# EAGLE design RES (EAGLE 7.7.0)
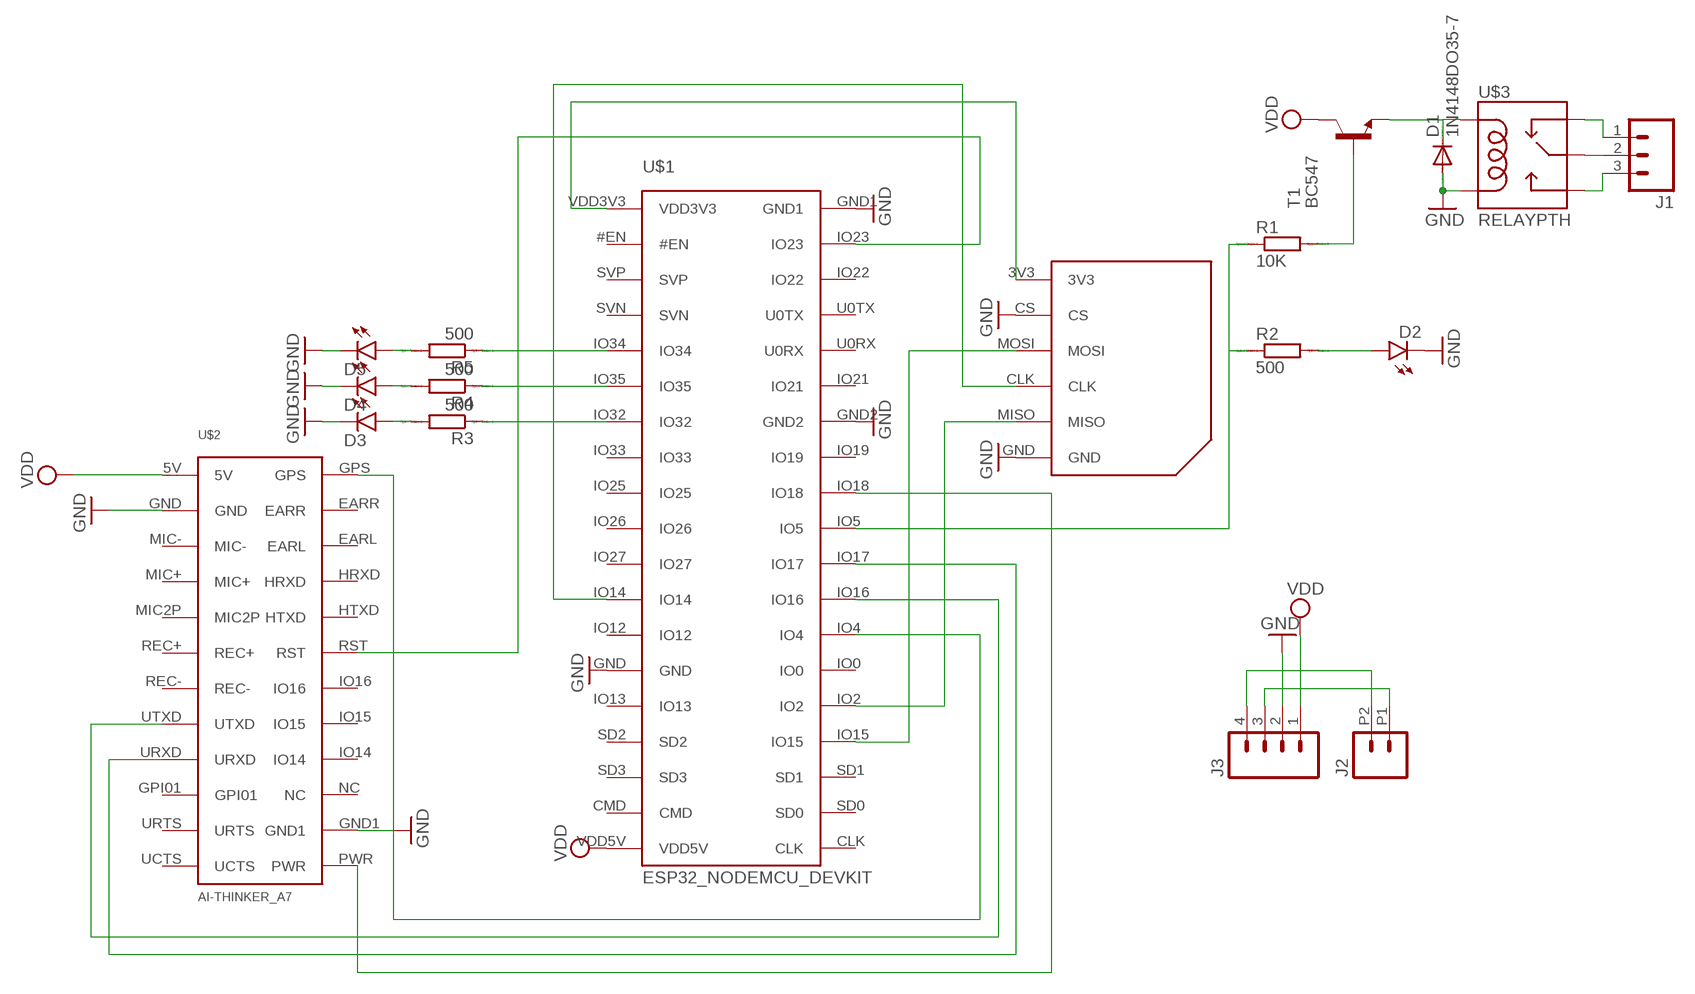
[diagram p0: schematic, sheet 1]

## Parts
D1  1N4148DO35-7  [DO35-7]
D2  LED3MM  [LED3MM]
D3  LED3MM  [LED3MM]
D4  LED3MM  [LED3MM]
D5  LED3MM  [LED3MM]
J1  M03-SCREW-5MM  [SCREWTERMINAL-5MM-3]
J2  M022.54MM_SCREWTERM  [1X02_2.54_SCREWTERM]
J3  M04SCREW  [SCREWTERMINAL-3.5MM-4]
R1  10K  R0204/7  [0204/7]
R2  500  R0204/7  [0204/7]
R3  500  R0204/7  [0204/7]
R4  500  R0204/7  [0204/7]
R5  500  R0204/7  [0204/7]
T1  BC547  [TO92]
U$1  ESP32_NODEMCU_DEVKIT  [ESP32_NODEMCU_PACKAGE]
U$2  AI-THINKER_A7  [AI-THINKER_A7_PAC]
U$3  RELAYPTH  [SRD-05VDC-SL-C]
U$4  SD-CARD_BREAKOUT  [SD-CARD_BREAKOUT_PACK]

## Nets
GND: D1.A D2.K(C) D3.K(C) D4.K(C) D5.K(C) J3.2 U$1.GND U$1.GND1 U$1.GND2 U$2.GND U$2.GND1 U$3.COIL0 U$4.CS U$4.GND
N$1: J1.1 U$3.SWCLOSED(SWCLOSE)
N$2: R1.1 R2.1 U$1.IO5
N$3: U$1.IO18 U$2.PWR
N$4: U$1.IO17 U$2.URXD
N$5: U$1.IO16 U$2.UTXD
N$6: U$1.IO4 U$2.GPS
N$7: R1.2 T1.2(B)
N$8: D1.C T1.1(E) U$3.COIL1
N$9: J1.2 U$3.SWCOMMON
N$10: D2.A R2.2
N$11: J1.3 U$3.SWOPEN
N$12: U$1.IO23 U$2.RST
N$13: J2.P1 J3.3
N$14: J2.P2 J3.4
N$15: U$1.VDD3V3 U$4.3V3
N$16: U$1.IO15 U$4.MOSI
N$17: U$1.IO14 U$4.CLK
N$18: U$1.IO2 U$4.MISO
N$19: D3.A R3.2
N$20: D4.A R4.2
N$21: D5.A R5.2
N$22: R5.1 U$1.IO34
N$23: R4.1 U$1.IO35
N$24: R3.1 U$1.IO32
VDD: J3.1 T1.3(C) U$1.VDD5V U$2.5V
Unconnected: U$1.#EN U$1.CLK U$1.CMD U$1.IO0 U$1.IO12 U$1.IO13 U$1.IO19 U$1.IO21 U$1.IO22 U$1.IO25 U$1.IO26 U$1.IO27 U$1.IO33 U$1.SD0 U$1.SD1 U$1.SD2 U$1.SD3 U$1.SVN U$1.SVP U$1.U0RX U$1.U0TX U$2.EARL U$2.EARR U$2.GPI01 U$2.HRXD U$2.HTXD U$2.IO14 U$2.IO15 U$2.IO16 U$2.MIC2P U$2.MIC+ U$2.MIC- U$2.NC U$2.REC+ U$2.REC- U$2.UCTS U$2.URTS

## Library data of the parts
D1 = diode:1N4148: DIODE high speed (Philips)
D2-D5 = SparkFun-LED:LED: LEDs Standard schematic elements and footprints for 5mm, 3mm, 1206, and 0603 sized LEDs. 5mm - Spark Fun Electronics SKU : COM-00529 (and others); PROD_ID: DIO-08794
J1 = SparkFun-Connectors:M03: Header 3 Standard 3-pin 0.1" header. Use with straight break away headers (SKU : PRT-00116), right angle break away headers (PRT-00553), swiss pins (PRT-00743), machine pins (PRT-00117), and female headers (PRT-00115). Molex polarized connector foot print use with SKU : PRT-08232 with associated crimp pins and housings.; STOREFRONT_ID: PRT-08433
J2 = SparkFun-Connectors:M02: Standard 2-pin 0.1" header. Use with - straight break away headers ( PRT-00116) - right angle break away headers (PRT-00553) - swiss pins (PRT-00743) - machine pins (PRT-00117) - female headers (PRT-00115) Molex polarized connector foot print use with: PRT-08233 with associated crimp pins and housings. 2.54_SCREWTERM for use with PRT-10571. 3.5mm Screw Terminal footprints for PRT-08084 5mm Screw Terminal footprints for use with PRT-08432
J3 = SparkFun-Connectors:M04: Header 4 Standard 4-pin 0.1" header. Use with straight break away headers (SKU : PRT-00116), right angle break away headers (PRT-00553), swiss pins (PRT-00743), machine pins (PRT-00117), and female headers (PRT-00115). Molex polarized connector foot print use with SKU : PRT-08231 with associated crimp pins and housings. 1MM SMD Version SKU: PRT-10208; PROD_ID: Combine 2x8399
R1-R5 = eagle-ltspice:R: RESISTOR, European symbol; SPICEMODEL: NONE; SPICEPREFIX: R
T1 = transistor:BC547: NPN TRANSISTOR
U$1 = esp32_nodemcu_devkit:ESP32_NODEMCU_DEVKIT
U$2 = AI-Thinker_A7:AI-THINKER_A7
U$3 = SRD-05VDC-SL-C:RELAY: SPDT relay (COM-00101)
U$4 = SD-CARD_BREAKOUT:SD-CARD_BREAKOUT

## Board
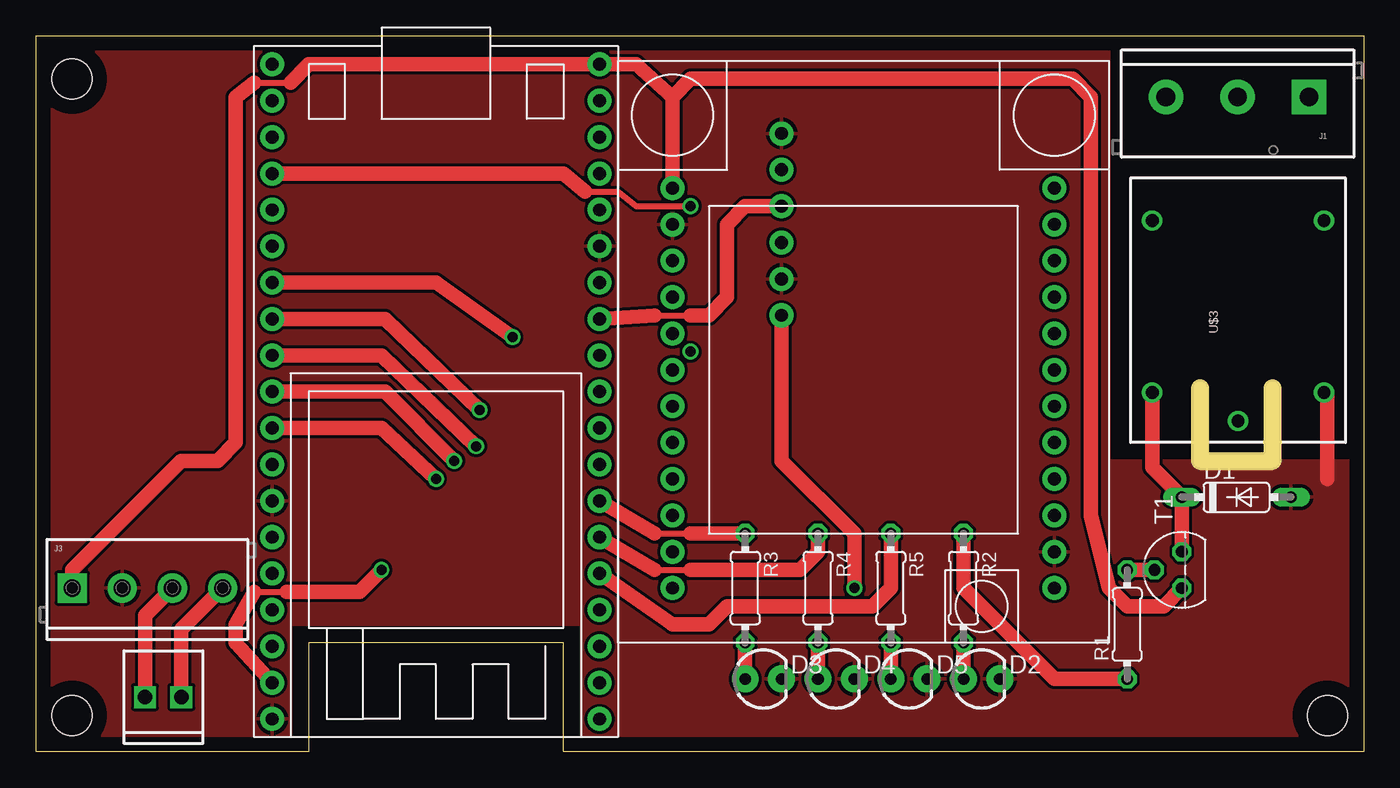
[diagram p1: board, top side]
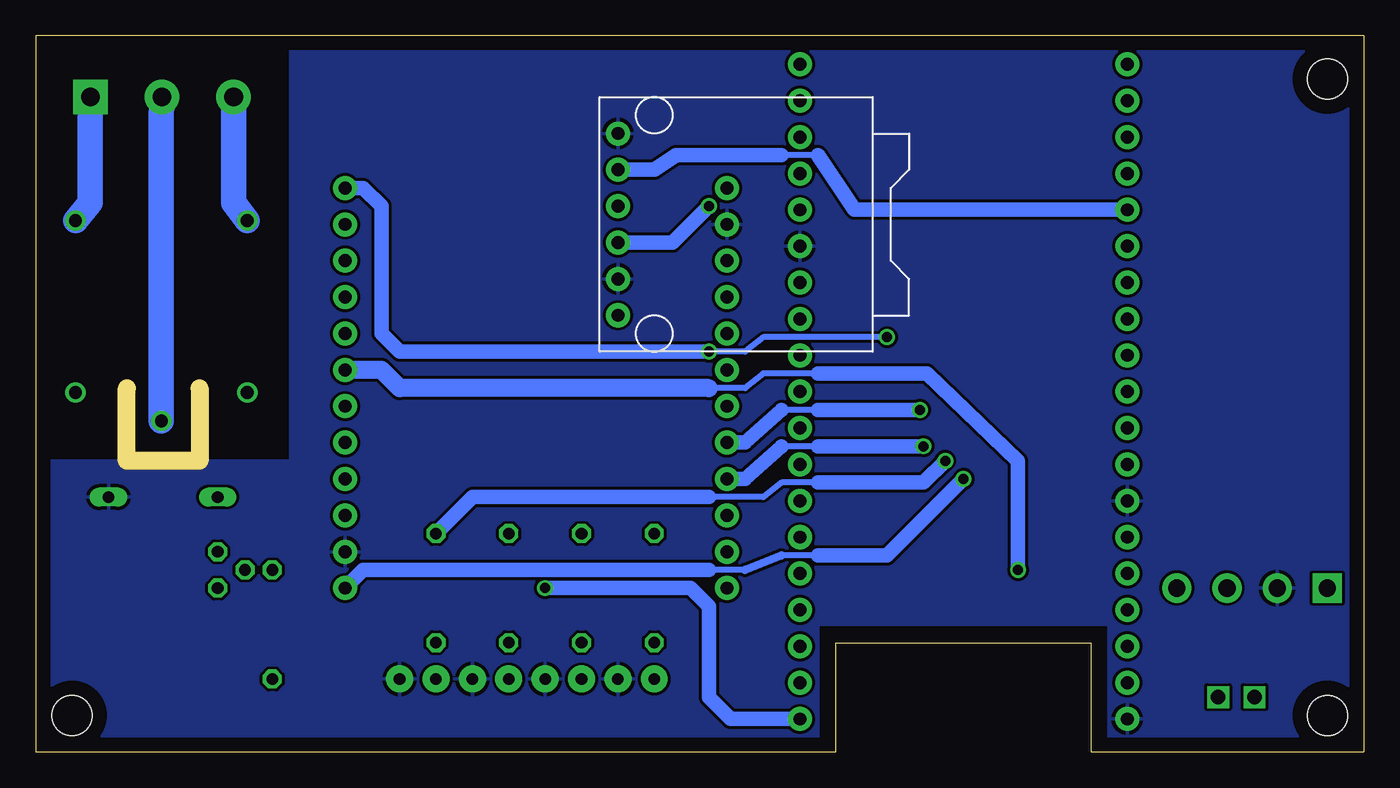
[diagram p2: board, bottom side, seen from below]

Size 92.71 x 50 mm. Coordinates in mm from the lower left corner, seen from the top.
Outline: 0,50 0,0 19.05,0 19.05,7.62 36.83,7.62 36.83,0 92.71,0 92.71,50 0,50
Copper layers (1*16): Top 0.035mm / dielectric 1.5mm / Bottom 0.035mm
Design rules "default *": minimum track width 10mil, minimum drill 24mil, track to track 8mil, track to pad 8mil, pad to pad 8mil, via to via 8mil, smd to smd 8mil, copper to edge 40mil, drill to drill 8mil, minimum pad ring 10mil, minimum via ring 8mil, stop-mask expansion 4mil, vias tented up to drill 0mil, thermal gap 10mil
Holes 2.8 mm at 2.54,2.54 2.54,46.99 90.17,2.54
Milling: 3 lines

### Footprints (pad centres in the part's own frame; a part is rotated, then mirrored left to right if it is on the bottom)
DO35-7 = drill 0.813 long: A 3.81,0; C -3.81,0
LED3MM = drill 0.813 pad 1.88: A -1.27,0; K 1.27,0
SCREWTERMINAL-5MM-3 = drill 1.3 pad 2.413 square: 1 0,0 | drill 1.3 pad 2.413: 2 5,0; 3 10,0
1X02_2.54_SCREWTERM = drill 1.016 square: P1 2.54,0; P2 0,0
SCREWTERMINAL-3.5MM-4 = drill 1.2 pad 2.032 square: 1 0,0 | drill 1.2 pad 2.032: 2 3.5,0; 3 7,0; 4 10.5,0
0204/7 = drill 0.813 octagon: 1 -3.81,0; 2 3.81,0
TO92 = drill 0.813 octagon: 1 1.27,0; 2 0,1.905; 3 -1.27,0
ESP32_NODEMCU_PACKAGE = drill 0.9 pad 1.676: #EN -6.35,20.32; CLK 16.51,-22.86; CMD -6.35,-20.32; GND -6.35,-10.16; GND1 16.51,22.86; GND2 16.51,7.62; IO0 16.51,-10.16; IO2 16.51,-12.7; IO4 16.51,-7.62; IO5 16.51,0; IO12 -6.35,-7.62; IO13 -6.35,-12.7; IO14 -6.35,-5.08; IO15 16.51,-15.24; IO16 16.51,-5.08; IO17 16.51,-2.54; IO18 16.51,2.54; IO19 16.51,5.08; IO21 16.51,10.16; IO22 16.51,17.78; IO23 16.51,20.32; IO25 -6.35,2.54; IO26 -6.35,0; IO27 -6.35,-2.54; IO32 -6.35,7.62; IO33 -6.35,5.08; IO34 -6.35,12.7; IO35 -6.35,10.16; SD0 16.51,-20.32; SD1 16.51,-17.78; SD2 -6.35,-15.24; SD3 -6.35,-17.78; SVN -6.35,15.24; SVP -6.35,17.78; U0RX 16.51,12.7; U0TX 16.51,15.24; VDD3V3 -6.35,22.86; VDD5V -6.35,-22.86
AI-THINKER_A7_PAC = drill 0.9 pad 1.676: 5V 0,0; EARL 26.67,-5.08; EARR 26.67,-2.54; GND 0,-2.54; GND1 26.67,-25.4; GPI01 0,-22.86; GPS 26.67,0; HRXD 26.67,-7.62; HTXD 26.67,-10.16; IO14 26.67,-20.32; IO15 26.67,-17.78; IO16 26.67,-15.24; MIC2P 0,-10.16; MIC+ 0,-7.62; MIC- 0,-5.08; NC 26.67,-22.86; PWR 26.67,-27.94; REC+ 0,-12.7; REC- 0,-15.24; RST 26.67,-12.7; UCTS 0,-27.94; URTS 0,-25.4; URXD 0,-20.32; UTXD 0,-17.78
SRD-05VDC-SL-C = drill 0.9: COIL0 -5.39,-6.12; COIL1 -5.39,5.88; SWCLOSED 6.61,-6.12; SWCOMMON -7.39,-0.12; SWOPEN 6.61,5.88
SD-CARD_BREAKOUT_PACK = drill 0.9 pad 1.676: 3V3 -6.35,5.08; CLK 1.27,5.08; CS -3.81,5.08; GND 6.35,5.08; MISO 3.81,5.08; MOSI -1.27,5.08

### Placement (x,y rotation side)
D1  83.82,17.78 0 top
D2  66.04,5.08 0 top
D3  50.8,5.08 0 top
D4  55.88,5.08 0 top
D5  60.96,5.08 0 top
J1  88.9,45.72 180 top
J2  10.16,3.81 180 top
J3  2.54,11.43 0 top
R1  76.2,8.89 90 top
R2  64.77,11.43 270 top
R3  49.53,11.43 270 top
R4  54.61,11.43 270 top
R5  59.69,11.43 270 top
T1  80.01,12.7 90 top
U$1  33.02,25.15 180 top
U$2  44.45,39.37 0 top
U$3  83.82,30.48 90 top
U$4  46.99,36.83 90 bottom

### Tracks (layer width: path | path; a pad name or v marks a point on that pad's centre or on a via)
GND
  Top 1.016: 90.17,19.05 90.17,24.86 U$3.COIL0
  pour Bottom: 0,0 0,49.53 74.93,49.53 74.93,20.32 92.71,20.32 92.71,0 38.1,0 38.1,8.89 17.78,8.89 17.78,0
  pour Top: 0,0 0,49.53 74.93,49.53 74.93,20.32 92.71,20.32 92.71,0 38.1,0 38.1,8.89 17.78,8.89 17.78,0
N$1
  Bottom 1.778: U$3.SWCLOSED 88.9,38.36 J1.1
N$2  (via drill 0.7)
  Top 1.016: R1.1 71.12,5.08 64.77,11.43 R2.1 | U$1.IO5 24.38,25.15 v29.21,20.32
  Bottom 0.406: 38.1,18.8 40.64,18.8 41.91,17.78 45.72,17.78
  Bottom 1.016: v29.21,20.32 30.73,18.8 38.1,18.8 | 45.72,17.78 62.23,17.78 R2.1
N$3  (via drill 0.7)
  Top 1.016: U$1.IO18 24.13,22.61 v27.94,19.05
  Bottom 0.406: 38.1,13.72 40.64,13.72 | 43.18,12.7 45.72,12.7
  Bottom 0.61: 40.64,13.72 43.18,12.7
  Bottom 1.016: v27.94,19.05 33.27,13.72 38.1,13.72 | 45.72,12.7 69.85,12.7 U$2.PWR
N$4  (via drill 0.7)
  Top 1.016: U$1.IO17 24.13,27.69 v30.73,21.34
  Bottom 0.406: 38.1,21.34 40.64,21.34
  Bottom 1.016: v30.73,21.34 38.1,21.34 | 40.64,21.34 43.18,19.05 U$2.URXD
N$5  (via drill 0.7)
  Top 1.016: U$1.IO16 24.38,30.23 v30.99,23.88
  Bottom 0.406: 38.1,23.88 40.64,23.88
  Bottom 1.016: v30.99,23.88 38.1,23.88 | 40.64,23.88 43.18,21.59 U$2.UTXD
N$6  (via drill 0.7)
  Top 1.016: U$1.IO4 27.94,32.77 v33.27,28.96
  Bottom 0.406: v33.27,28.96 41.91,28.96 43.18,27.94 v45.72,27.94
  Bottom 1.016: v45.72,27.94 67.31,27.94 68.58,29.21 68.58,38.1 69.85,39.37 U$2.GPS
N$7
  Top 1.016: R1.2 T1.2
N$8
  Top 1.016: U$3.COIL1 77.94,19.85 D1.C T1.1
N$9
  Bottom 1.778: J1.2 83.94,44.45 U$3.SWCOMMON
N$10
  Top 1.016: R2.2 D2.A
N$11
  Bottom 1.778: U$3.SWOPEN 78.9,38.36 J1.3
N$12  (via drill 0.7)
  Top 0.406: 15.24,11.18 17.53,11.18
  Top 1.016: U$1.IO23 13.97,7.62 13.97,8.89 15.24,11.18 | 17.53,11.18 22.61,11.18 v24.13,12.7
  Bottom 0.406: 38.1,26.42 41.91,26.42 43.18,25.4 45.72,25.4
  Bottom 1.016: v24.13,12.7 24.13,20.32 30.48,26.42 38.1,26.42
  Bottom 1.27: 45.72,25.4 67.31,25.4 68.58,26.67 U$2.RST
N$13
  Top 1.016: J2.P1 7.62,9.51 J3.3
N$14
  Top 1.016: J2.P2 10.16,8.55 J3.4
N$15  (via drill 0.7)
  Top 1.016: U$4.3V3 52.07,20.32 57.15,15.24 v57.15,11.43
  Bottom 1.016: v57.15,11.43 46.99,11.43 45.72,10.16 45.72,3.81 44.2,2.29 U$1.VDD3V3
N$16  (via drill 0.7)
  Top 0.406: 38.35,39.12 40.64,39.12 41.91,38.1 v45.72,38.1
  Top 1.016: U$1.IO15 36.83,40.39 38.35,39.12
  Bottom 1.016: v45.72,38.1 48.26,35.56 U$4.MOSI
N$17
  Top 0.406: 43.18,30.48 45.72,30.48
  Top 1.016: U$1.IO14 43.18,30.48 | 45.72,30.48 46.99,30.48 48.26,31.75 48.26,36.83 49.53,38.1 U$4.CLK
N$18
  Bottom 0.406: 38.1,41.66 40.64,41.66
  Bottom 1.016: U$1.IO2 35.56,37.85 38.1,41.66 | 40.64,41.66 48.01,41.66 49.53,40.64 U$4.MISO
N$19
  Top 1.016: R3.2 D3.A
N$20
  Top 1.016: R4.2 D4.A
N$21
  Top 1.016: R5.2 D5.A
N$22
  Top 1.016: U$1.IO34 44.45,8.89 46.99,8.89 48.26,10.16 58.42,10.16 59.69,11.43 R5.1
N$23
  Top 0.406: 43.18,12.7 45.72,12.7
  Top 1.016: U$1.IO35 43.18,12.7 | 45.72,12.7 53.34,12.7 54.61,13.97 R4.1
N$24
  Top 0.406: 43.18,15.24 45.72,15.24
  Top 1.016: U$1.IO32 43.18,15.24 | 45.72,15.24 R3.1
VDD
  Top 0.406: 15.24,46.74 17.78,46.74
  Top 1.016: J3.1 2.54,12.7 10.16,20.32 12.7,20.32 13.97,21.59 13.97,45.72 15.24,46.74 | 17.78,46.74 19.05,48.01 U$1.VDD5V 41.91,48.01 44.45,45.72 | 44.45,45.72 U$2.5V | T1.3 78.74,10.16 76.2,10.16 74.93,11.43 73.66,16.51 73.66,45.72 72.39,46.99 45.72,46.99 44.45,45.72